# Altium schematic sheet precharge_relays.SchDoc: Precharge Relays
size A4; Engineer: Shelby Riggleman; Organization: Badgerloop; Address1: 133 Engineering Research; Address2: Building; Address3: Madison, WI 53715; Revision: 1; SheetNumber: 4
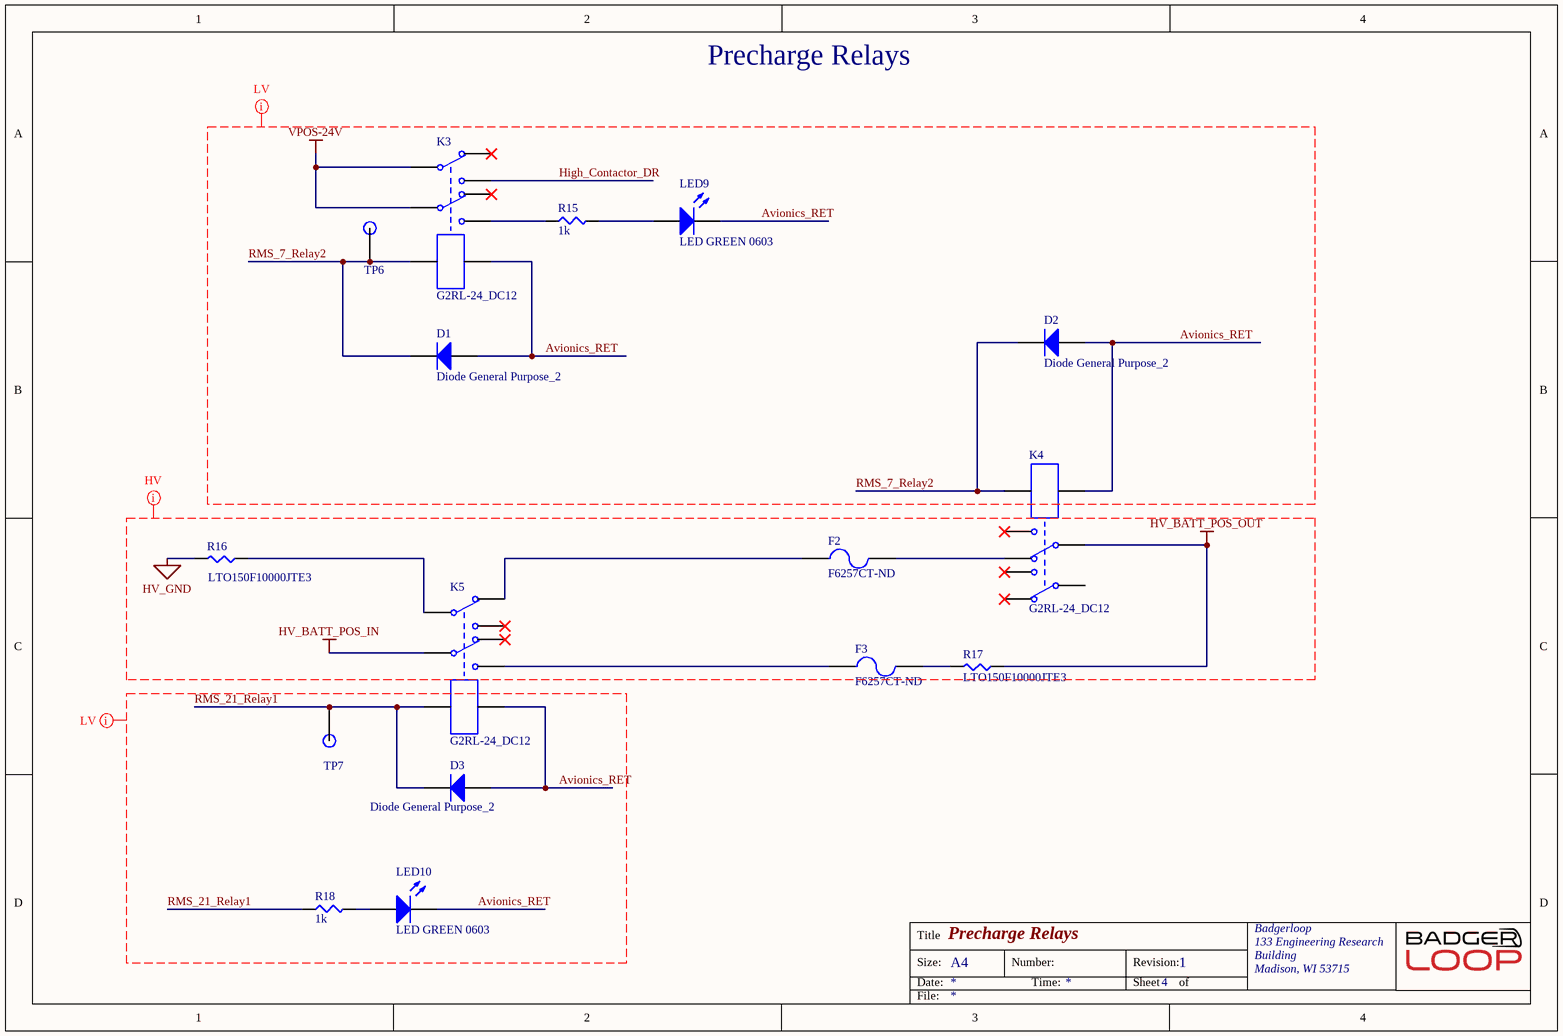
[diagram p0: precharge_relays.SchDoc]

## Parts
D1  Diode General Purpose_2  [SODFL250X110-2N]
D2  Diode General Purpose_2  [SODFL250X110-2N]
D3  Diode General Purpose_2  [SODFL250X110-2N]
F2  F6257CT-ND  [FUSE BOARD MNT 500MA 350VAC/VDC]
F3  F6257CT-ND  [FUSE BOARD MNT 500MA 350VAC/VDC]
K3  G2RL-24_DC12  [G2RL]
K4  G2RL-24_DC12  [G2RL]
K5  G2RL-24_DC12  [G2RL]
LED9  LED GREEN 0603  [LED 0603 GREEN]
LED10  LED GREEN 0603  [LED 0603 GREEN]
R15  1k  [SMD-0805-RES]
R16  LTO150F10000JTE3  [TO-247-2]
R17  LTO150F10000JTE3  [TO-247-2]
R18  1k  [SMD-0805-RES]
TP6  TP  [Test Point]  (value not drawn)
TP7  TP  [Test Point]  (value not drawn)

## Nets
HV_BATT_POS_IN: K5.6
HV_BATT_POS_OUT: K4.6 R17.1
HV_GND: R16.2
VPOS-24V: K3.3 K3.6
Avionics_RET: D1.1(A) D2.1(A) D3.1(A) K3.8 K4.1 K5.8 LED9.2(K) LED10.2(K)
High_Contactor_DR: K3.4
RMS_7_Relay2: D1.2(K) D2.2(K) K3.1 K4.8 TP6.1
RMS_21_Relay1: D3.2(K) K5.1 R18.1 TP7.1
NetF2_1: F2.1 K5.2
NetF2_2: F2.2 K4.7
NetF3_1: F3.1 K5.5
NetF3_2: F3.2 R17.2
NetK3_5: K3.5 R15.1
NetK5_3: K5.3 R16.1
NetLED9_1: LED9.1(A) R15.2
NetLED10_1: LED10.1(A) R18.2

Not connected (* = marked no-connect by the designer): K3 2* 7*; K4 2* 3 4* 5*; K5 4* 7*

## Layout directives
net class High Voltage: HV_BATT_POS_IN, HV_BATT_POS_OUT, HV_GND
net class Low Voltage: Avionics_RET, High_Contactor_DR, RMS_7_Relay2, RMS_21_Relay1, VPOS-24V

## Notes on the sheet
- Precharge Relays
- Title
- Size:
- Date:
- A4
- Number:
- Time:
- Revision:
- Sheet
- of
- File:

## Library data of the parts
D1-D3 = Diode General Purpose_2: DIODE GEN PURP 20V 350MA SOD323; Manufacturer: Diodes Incorporated; Manufacturer P/N: SD103CWS-7-F; Digikey P/N: SD103CWS-FDIDKR-ND; Package / Case: SOD323; Do Not Populate: *; ComponentLink1Description: Digikey; ComponentLink1URL: https://www.digikey.com/product-detail/en/diodes-incorporated/SD103CWS-7-F/SD103CWS-FDIDKR-ND/1836772; ComponentLink2Description: Datasheet; ComponentLink2URL: https://www.diodes.com/assets/Datasheets/ds30101.pdf; ComponentLink3Description: Dimensions; ComponentLink3URL: https://www.diodes.com/assets/Package-Files/SOD323.pdf
F2 F3 = F6257CT-ND: FUSE BOARD MNT 500MA 350VAC/VDC; Manufacturer: Littelfuse; Manufacturer P/N: 46205000000; Digikey P/N: F6257CT-ND; Digikey Link: https://www.digikey.com/product-detail/en/littelfuse-inc/46205000000/F6257CT-ND/4331764
K3-K5 = G2RL-24_DC12: RELAY GEN PURPOSE DPDT 8A 12V; Manufacturer: Omron Electronics; Manufacturer P/N: G2RL-24 DC12; Digikey Link: https://www.digikey.com/product-detail/en/omron-electronics-inc-emc-div/G2RL-24-DC12/Z147-ND/307667; Digikey P/N: Z147-ND
LED9 LED10 = LED GREEN 0603: Manufacturer: Lite-On Inc.; Manufacturer P/N: LTST-C190KGKT; Digikey P/N: 160-1435-1-ND; Package / Case: 0603; Color: GREEN
R15 R18 = ERJ-6ENF1001V: RES SMD 1K OHM 1% 1/8W 0805; Manufacturer: Panasonic Electronic Components; Factory Stock: 0; Unit Price (USD): 0.00729; @ qty: 1500; Minimum Quantity: 1; Power (Watts): 0.125W, 1/8W; Temperature Coefficient: ±100ppm/°C; Part Number: ERJ-6ENF1001V; Datasheets: http://industrial.panasonic.com/www-cgi/jvcr13pz.cgi?E+PZ+3+AOA0002+ERJ6ENF1001V+7+WW; Image: //media.digikey.com/Renders/Panasonic%20Renders/ERJ-0805%20Pkg.jpg; Digi-Key Part Number: P1.00KCCT-ND; Quantity Available: 12895103; Packaging: Cut Tape (CT); Series: ERJ; Part Status: Active; Value: 1k; Tolerance: ±1%; Composition: Thick Film; Features: Automotive AEC-Q200; Operating Temperature: -55°C ~ 155°C; Package / Case: 0805 (2012 Metric); Supplier Device Package: 0805; Size / Dimension: 0.079" L x 0.049" W (2.00mm x 1.25mm); Height - Seated (Max): 0.028" (0.70mm); Number of Terminations: 2; Failure Rate: -
R16 R17 = LTO150F10000JTE3: RES 1K OHM 5% 150W TO247-2; Manufacturer: Vishay Sfernice; Supplier 1: Digi-Key; Manufacturer Part Number: LTO150F10000JTE3; Stock 1: 9; Pricing 1: 1=12.19, 10=11.084, 100=7.8972, 1000=7.17808 (USD); ComponentLink1URL: https://media.digikey.com/pdf/Data%20Sheets/Vishay%20Sfernice%20PDFs/LTO_150_Series.pdf?src-supplier=Digi-Key; ComponentLink1Description: https://media.digikey.com/pdf/Data%20Sheets/Vishay%20Sfernice%20PDFs/LTO_150_Series.pdf?src-supplier=Digi-Key; Supplier Part Number 1: 716-1214-ND; Digikey Link: https://www.digikey.com/products/en/resistors/through-hole-resistors/53?k=Power+Resistors&k=&pkeyword=Power+Resistors&sv=0&pv2=127&sf=0&FV=ffe00035%2Cmu1kOhms%7C2085%7C0%2Cmu1kOhms%7C2085%7C1&quantity=&ColumnSort=0&page=1&pageSize=25
TP6 TP7 = TP: SMD TEST POINT